# Altium schematic sheet TenzoADC.SchDoc
size A4
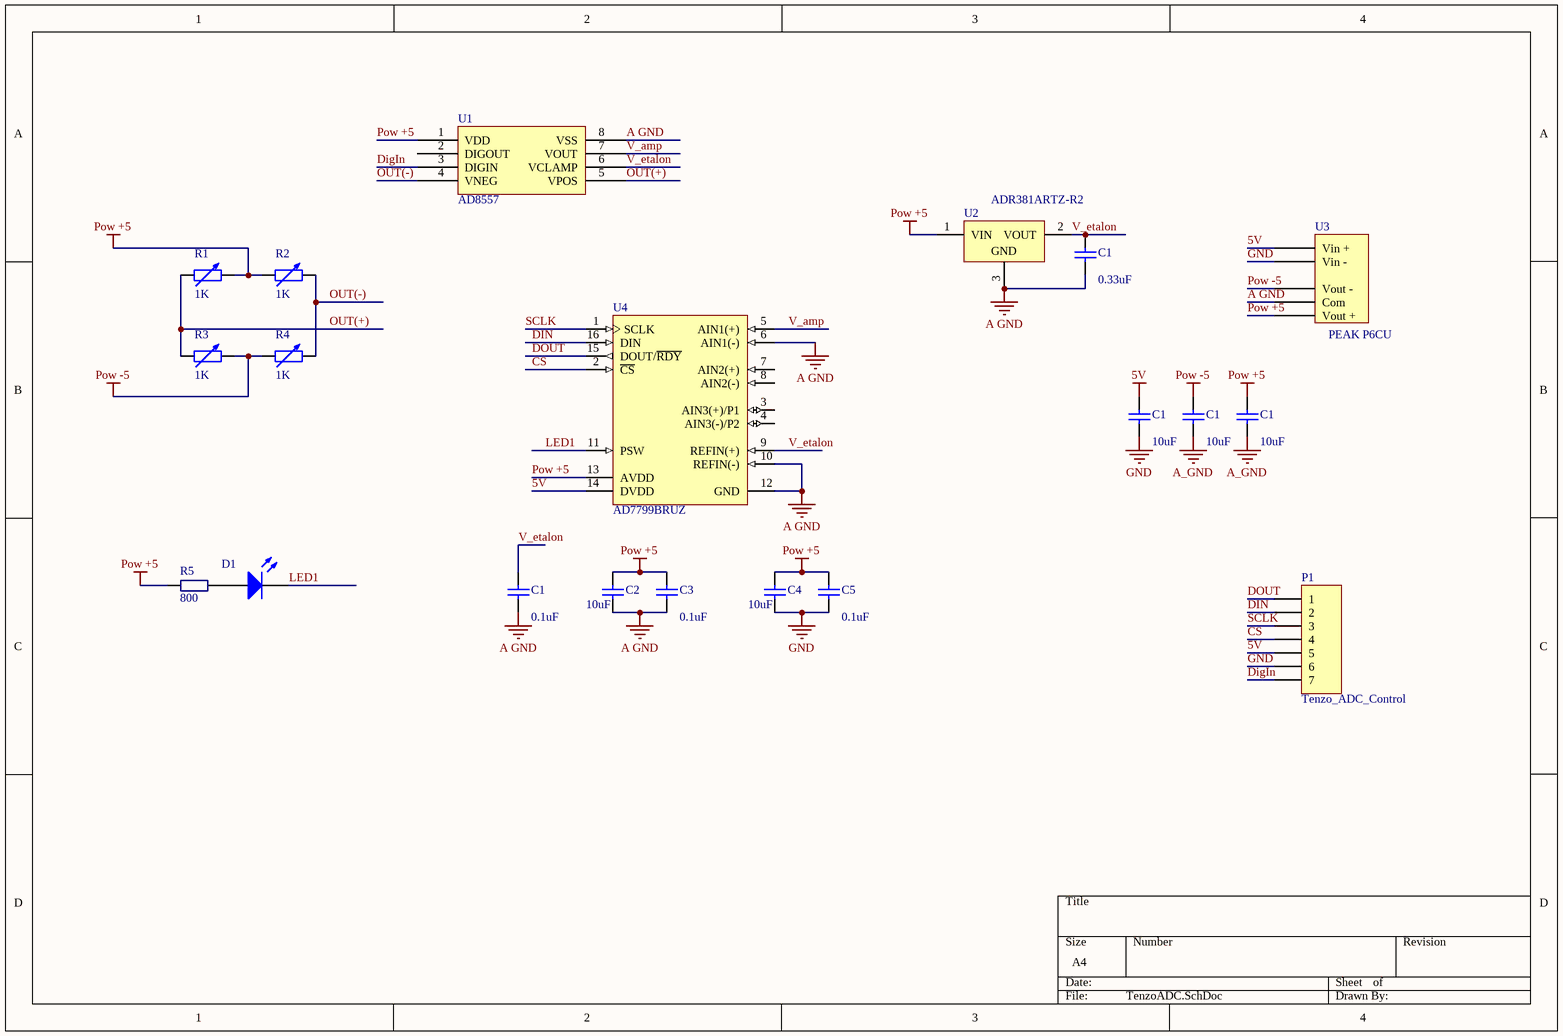
[diagram p0: TenzoADC.SchDoc]

## Parts
(Parts that share a designator on the sheet are numbered #1, #2 ... from top to bottom, then left to right.)
C1#1  value 0.33uF  [1608[0603]]  (hidden comment: Cap Semi)
C1#2  value 10uF  [1608[0603]]  (hidden comment: Cap Semi)
C1#3  value 10uF  [1608[0603]]  (hidden comment: Cap Semi)
C1#4  value 10uF  [1608[0603]]  (hidden comment: Cap Semi)
C1#5  value 0.1uF  [1608[0603]]  (hidden comment: Cap Semi)
C2  value 10uF  [1608[0603]]  (hidden comment: Cap Semi)
C3  value 0.1uF  [1608[0603]]  (hidden comment: Cap Semi)
C4  value 10uF  [1608[0603]]  (hidden comment: Cap Semi)
C5  value 0.1uF  [1608[0603]]  (hidden comment: Cap Semi)
D1  LED1  [LED-1]  (value not drawn)
P1  Tenzo_ADC_Control  [HDR1X7]
R1  value 1K  [AXIAL-0.6]  (hidden comment: Res Adj2)
R2  value 1K  [AXIAL-0.6]  (hidden comment: Res Adj2)
R3  value 1K  [AXIAL-0.6]  (hidden comment: Res Adj2)
R4  value 1K  [AXIAL-0.6]  (hidden comment: Res Adj2)
R5  800  [J1-0603]
U1  AD8557  [NSO8_L]
U2  ADR381ARTZ-R2  [ADI-RT-3_N]
U3  PEAK P6CU  [DIP6]
U4  AD7799BRUZ  [RU-16_M]

## Nets
5V: C1#2.2 P1.5 U3.1(Vin_+) U4.14(DVDD)
A GND: C1#1.1 C1#5.1 C2.1 C3.1 U1.8(VSS) U2.3(GND) U3.4(Com) U4.6(AIN1(-)) U4.10(REFIN(-)) U4.12(GND)
A_GND: C1#3.1 C1#4.1
GND: C1#2.1 C4.1 C5.1 P1.6 U3.2(Vin_-)
Pow +5: C1#4.2 C2.2 C3.2 C4.2 C5.2 R1.2 R2.1 R5.2 U1.1(VDD) U2.1(VIN) U3.5(Vout_+) U4.13(AVDD)
Pow -5: C1#3.2 R3.2 R4.1 U3.3(Vout_-)
CS: P1.4 U4.2(~{CS})
DigIn: P1.7 U1.3(DIGIN)
DIN: P1.2 U4.16(DIN)
DOUT: P1.1 U4.15(DOUT/~{RDY})
LED1: D1.2(K) U4.11(PSW)
OUT(+): R1.1 R3.1 U1.5(VPOS)
OUT(-): R2.2 R4.2 U1.4(VNEG)
SCLK: P1.3 U4.1(SCLK)
V_amp: U1.7(VOUT) U4.5(AIN1(+))
V_etalon: C1#1.2 C1#5.2 U1.6(VCLAMP) U2.2(VOUT) U4.9(REFIN(+))
NetD1_1: D1.1(A) R5.1

Not connected (* = marked no-connect by the designer): U1 2(DIGOUT); U4 3(AIN3(+)/P1) 4(AIN3(-)/P2) 7(AIN2(+)) 8(AIN2(-))

## Library data of the parts
C1#1-C1#5 C2-C5 = Cap Semi: Capacitor (Semiconductor SIM Model); Published: 8-Jun-2000; LatestRevisionDate: 29-May-2009; LatestRevisionNote: IPC-7351 Footprint Added.; PackageReference: C1206; Publisher: Altium Limited; PackageDescription: Chip Capacitor
D1 = LED1: Typical RED GaAs LED; Published: 8-Jun-2000; LatestRevisionDate: 08-Jul-2005; LatestRevisionNote: Mech Layer 1 removed.; PackageReference: LED-1; Publisher: Altium Limited; PackageDescription: LED; 2 Leads
P1 = Header 7: Header, 7-Pin; LatestRevisionDate: 17-Jul-2002; LatestRevisionNote: Re-released for DXP Platform.; Publisher: Altium Limited
R1-R4 = Res Adj2: Variable Resistor; Set Position: 0.5; Published: 8-Jun-2000; LatestRevisionDate: 17-Jul-2002; LatestRevisionNote: Re-released for DXP Platform.; PackageReference: AXIAL-0.6; Publisher: Altium Limited; PackageDescription: Axial Device, Thru-Hole; 2 Leads; 0.6 in Pin Spacing
R5 = Res_SMD: Resistor; Published: 8-Jun-2000; LatestRevisionDate: 29-May-2009; LatestRevisionNote: IPC-7351 Footprint Added.; PackageReference: J1-0603; Publisher: Altium Limited; PackageDescription: Chip Resistor; Value: 800
U1 = AD8557: Digitally Programmable Sensor Signal Amplifier
U2 = ADR381ARTZ-R2: Precision Low Drift Voltage Reference, 2.5 V Output, 2.8 to 18 V Supply, Industrial, 3-pin SOT23 (RT-3), Reel; Manufacturer: Analog Devices; Max V Supply (V): 18; Min V Supply (V): 2.8; Ref Out TC (ppm/C): 5; Vout: 2.5; DatasheetVersion: Rev. C; PackageVersion: 011909-C, 02/2009; PackageReference: RT-3; PackageDescription: 3-Pin Small Outline Transistor Package, Body 2.9 x 1.3 mm, Pitch 0.96 mm; Supplier 1: Digi-Key; Supplier Part Number 1: ADR381ARTZ-R2TR-ND; Supplier 2: Digi-Key; Supplier Part Number 2: ADR381ARTZ-R2CT-ND; Supplier 3: Digi-Key; Supplier Part Number 3: ADR381ARTZ-R2DKR-ND; Supplier 4: Farnell; Supplier Part Number 4: 2377037; Supplier 5: Mouser; Supplier Part Number 5: 584-ADR381ARTZ-R2; Packing: Reel; Operating Temp Range: -40 to +85 degC; Mounting Technology: Surface Mount; Code_JEDEC: TO-236-AB; PartNumber: ADR381ARTZ-R2; ComponentLink1Description: Manufacturer URL; ComponentLink1URL: http://www.analog.com/en/index.html; ComponentLink2Description: Datasheet; ComponentLink2URL: http://www.analog.com/static/imported-files/data_sheets/ADR380_381.pdf; ComponentLink3Description: Package Specification; ComponentLink3URL: http:/www.analog.com/static/imported-files/packages/PKG_PDF/SOT-23-3 (RT)/RT_3.pdf; ComponentLink4Description: URL Link1; ComponentLink4URL: Product URL:http://www.analog.com/en/special-linear-functions/voltage-references/adr381/products/product.html
U3 = PEAK P6CU: 1W  dual output DC-DC converter
U4 = AD7799BRUZ: 3 Channel 24-Bit Low Noise Low Power Sigma-Delta Analog-to-Digital Converter with Serial, SPI Interface and On-Chip In-Amp, 470SPS, -40 to +105 degC, RU-16, Pb-Free, Tube; Generic Part Number: AD7799; Manufacturer: Analog Devices; Resolution (Bits): 24; Channels: 3; Throughput Rate (SPS): 470; Interface: Ser, SPI; DatasheetVersion: Rev.A; PackageVersion: Nov-2002; PackageReference: RU-16; PackageDescription: 16-Lead Thin Shrink Small Outline Package [TSSOP]; Supplier 1: Digi-Key; Supplier Part Number 1: AD7799BRUZ-ND; Supplier 2: Farnell; Supplier Part Number 2: 1078327; Supplier 3: Newark; Supplier Part Number 3: 19M0901; Supplier 4: Mouser; Supplier Part Number 4: 584-AD7799BRUZ; RoHS: Y; Packing: Tube; Mounting Technology: Surface Mount; Code_JEDEC: MO-153-AB; PartNumber: AD7799BRUZ; ComponentLink1Description: Manufacturer URL; ComponentLink1URL: http://www.analog.com/en/index.html; ComponentLink2Description: Datasheet; ComponentLink2URL: http://www.analog.com/static/imported-files/data_sheets/AD7798_7799.pdf; ComponentLink3Description: Package Specification; ComponentLink3URL: http://www.analog.com/static/imported-files/packages/36244347913743854010197452789RU16.pdf; ComponentLink4Description: Product URL; ComponentLink4URL: http://www.analog.com/en/analog-to-digital-converters/ad-converters/ad7799/products/product.html